# Altium schematic sheet Top.SchDoc
size B; Revision: 1.1; SheetNumber: 1; SheetTotal: 6
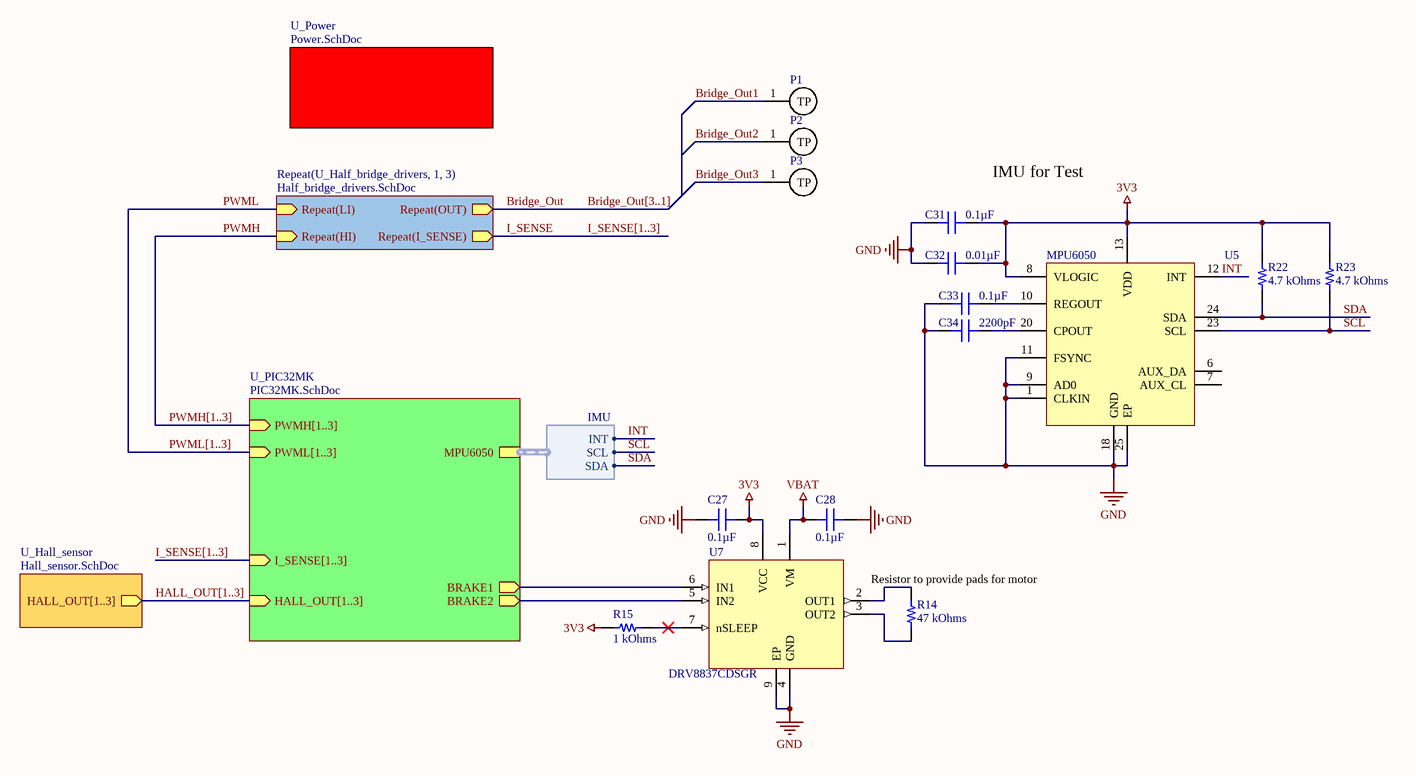
[diagram p0: Top.SchDoc]

## Parts
C27  0.1µF  [CAP 0603_1608]
C28  0.1µF  [CAP 0603_1608]
C31  0.1µF  [CAP 0603_1608]
C32  0.01µF  [CAP 0603_1608]
C33  0.1µF  [CAP 0603_1608]
C34  2200pF  [CAP 0603_1608]
P1  TP  [2mmHole]  (value not drawn)
P2  TP  [2mmHole]  (value not drawn)
P3  TP  [2mmHole]  (value not drawn)
R14  47 kOhms  [RES 2512_6432]
R15  1 kOhms  [RES 0603_1608]
R22  4.7 kOhms  [RES 0603_1608]
R23  4.7 kOhms  [RES 0603_1608]
U5  MPU6050  [IC_MPU6050]
U7  DRV8837CDSGR  [SON50P200X200X80-9N]

## Sub-sheets
Repeat(U_Half_bridge_drivers, 1, 3) = Half_bridge_drivers.SchDoc: Repeat(LI) (in), Repeat(HI) (in), Repeat(OUT) (out), Repeat(I_SENSE) (out)
U_Hall_sensor = Hall_sensor.SchDoc: HALL_OUT[1..3] (out)
U_PIC32MK = PIC32MK.SchDoc: HALL_OUT[1..3] (in), PWMH[1..3] (in), PWML[1..3] (in), BRAKE2 (out), BRAKE1 (out), I_SENSE[1..3] (in), MPU6050 (harness IMU)
U_Power = Power.SchDoc: no entries

## Harnesses
IMU: INT, SCL, SDA

## Nets
3V3: C27.2 C31.2 C32.2 R15.2 R22.2 R23.2 U5.8(VLOGIC) U5.13(VDD) U7.8(VCC)
GND: C27.1 C28.2 C31.1 C32.1 C33.2 C34.2 U5.1(CLKIN) U5.9(AD0) U5.11(FSYNC) U5.18(GND) U5.25(EP) U7.4(GND) U7.9(EP)
VBAT: C28.1 U7.1(VM)
Bridge_Out: sheet Repeat(U_Half_bridge_drivers, 1, 3)/Repeat(OUT)
Bridge_Out1: P1.1(TP)
Bridge_Out2: P2.1(TP)
Bridge_Out3: P3.1(TP)
I_SENSE: sheet Repeat(U_Half_bridge_drivers, 1, 3)/Repeat(I_SENSE)
INT: U5.12(INT) ; sheet U_PIC32MK/MPU6050.INT
PWMH: sheet Repeat(U_Half_bridge_drivers, 1, 3)/Repeat(HI)
PWML: sheet Repeat(U_Half_bridge_drivers, 1, 3)/Repeat(LI)
SCL: R23.1 U5.23(SCL) ; sheet U_PIC32MK/MPU6050.SCL
SDA: R22.1 U5.24(SDA) ; sheet U_PIC32MK/MPU6050.SDA
NetC33_1: C33.1 U5.10(REGOUT)
NetC34_1: C34.1 U5.20(CPOUT)
NetR14_1: R14.1 U7.2(OUT1)
NetR14_2: R14.2 U7.3(OUT2)
NetR15_1: R15.1 U7.7(nSLEEP)
NetU7_5: U7.5(IN2) ; sheet U_PIC32MK/BRAKE2
NetU7_6: U7.6(IN1) ; sheet U_PIC32MK/BRAKE1

Not connected (* = marked no-connect by the designer): U5 6(AUX_DA) 7(AUX_CL)

## Buses and harness runs
bus Bridge_Out[3..1]
bus HALL_OUT[1..3] = sheet U_Hall_sensor/HALL_OUT[1..3] = sheet U_PIC32MK/HALL_OUT[1..3]
bus I_SENSE[1..3]
bus I_SENSE[1..3] = sheet U_PIC32MK/I_SENSE[1..3]
bus PWMH[1..3] = sheet U_PIC32MK/PWMH[1..3]
bus PWML[1..3] = sheet U_PIC32MK/PWML[1..3]

## Notes on the sheet
- (near C31) IMU for Test
- (near R14) Resistor to provide pads for motor

## Library data of the parts
C27 C28 C31 C33 = GCG188R92A104KA03D: CAP CER 0.1UF 100V 0603 EPOXY; Manufacturer: Murata Electronics; Temperature Coefficient: X8R; Tolerance: ±10%; Part Number: GCG188R92A104KA03D; Value: 0.1µF; Applications: Automotive; Capacitance: 0.1µF; ComponentLink1Description: Datasheet; ComponentLink1URL: https://search.murata.co.jp/Ceramy/image/img/A01X/G101/ENG/GCG188R92A104KA03-01.pdf; ComponentLink2Description: DigiKey Link; ComponentLink2URL: http://digikey.com/product-detail/en/murata-electronics/GCG188R92A104KA03D/490-18197-1-ND/9867926; Device Package: 0603 (1608 Metric); Features: Epoxy Mountable; LastUpdated: 21-Jan-20 12:01:59 AM; Lifecycle Status: Active; Minimum Order: 1; Mounting Type: Surface Mount, MLCC, Epoxy; Operating Temperature: -55°C ~ 150°C; Package / Case: 0603 (1608 Metric); Packaging: TapeAndReel; PartId: 9025; Part Status: Active; Price: 0.07; Ratings: AEC-Q200; Series: GCG; Size / Dimension: 0.063" L x 0.031" W (1.60mm x 0.80mm); Supplier 1: DigiKey; Supplier Part Number 1: 490-18197-1-ND; Thickness (Max): 0.035" (0.90mm); Voltage - Rated: 100V
C32 = C0603C103KARACAUTO: CAP CER 0.01UF 250V X7R 0603; Manufacturer: KEMET; Tolerance: ±10%; Part Number: C0603C103KARACAUTO; Value: 0.01µF; Applications: Automotive, Bypass, Decoupling; Capacitance: 0.01µF; ComponentLink1Description: Datasheet; ComponentLink1URL: https://api.kemet.com/component-edge/download/datasheet/C0603C103KARACAUTO.pdf; ComponentLink2Description: DigiKey Link; ComponentLink2URL: http://digikey.com/product-detail/en/kemet/C0603C103KARACAUTO/399-17960-1-ND/9084030; Device Package: 0603 (1608 Metric); LastUpdated: 13-Aug-20 10:21:06 AM; Lifecycle Status: Active; Minimum Order: 1; Mounting Type: Surface Mount, MLCC; Operating Temperature: -55°C ~ 125°C; Package / Case: 0603 (1608 Metric); Packaging: TapeAndReel; PartId: 15195; Part Status: Active; Price: 0.25; Ratings: AEC-Q200; Series: SMD Auto X7R; Size / Dimension: 0.063" L x 0.031" W (1.60mm x 0.80mm); Supplier 1: DigiKey; Supplier Part Number 1: 399-17960-1-ND; Temperature Coefficient: X7R; Thickness (Max): 0.034" (0.87mm)
C34 = CGA3E2X8R1H222M080AD: CAP CER 2200PF 50V 0603 EPOXY; Manufacturer: TDK Corporation; Temperature Coefficient: X8R; Tolerance: ±20%; Part Number: CGA3E2X8R1H222M080AD; Value: 2200pF; Applications: Automotive; Capacitance: 2200pF; ComponentLink1Description: Datasheet; ComponentLink1URL: https://product.tdk.com/info/en/catalog/datasheets/mlcc_automotive_epoxy_en.pdf?ref_disty=digikey; ComponentLink2Description: DigiKey Link; ComponentLink2URL: http://digikey.com/product-detail/en/tdk-corporation/CGA3E2X8R1H222M080AD/445-9890-1-ND/3931817; Device Package: 0603 (1608 Metric); Features: Epoxy Mountable; LastUpdated: 13-Aug-20 10:19:25 AM; Lifecycle Status: Active; Minimum Order: 1; Mounting Type: Surface Mount, MLCC, Epoxy; Operating Temperature: -55°C ~ 150°C; Package / Case: 0603 (1608 Metric); Packaging: TapeAndReel; PartId: 17643; Part Status: Active; Price: 0.05; Ratings: AEC-Q200; Series: CGA; Size / Dimension: 0.063" L x 0.031" W (1.60mm x 0.80mm); Supplier 1: DigiKey; Supplier Part Number 1: 445-9890-1-ND; Thickness (Max): 0.031" (0.80mm)
R14 = RK73B3ATTE473J: RES 47K OHM 5% 1W 2512; Manufacturer: KOA Speer Electronics, Inc.; Temperature Coefficient: ±200ppm/°C; Part Number: RK73B3ATTE473J; ComponentLink1Description: Datasheet; ComponentLink1URL: http://www.koaspeer.com/catimages/Products/RK73B/RK73B.pdf; ComponentLink2Description: DigiKey Link; ComponentLink2URL: http://digikey.com/product-detail/en/koa-speer-electronics-inc/RK73B3ATTE473J/2019-RK73B3ATTE473JCT-ND/10425370; Composition: Thick Film; Device Package: 2512 (6432 Metric); Features: Automotive AEC-Q200, Moisture Resistant; Height - Seated (Max): 0.028" (0.70mm); LastUpdated: 21-Jan-20 4:26:21 AM; Lifecycle Status: Active; Minimum Order: 1; Number of Terminations: 2; Operating Temperature: -55°C ~ 155°C; Package / Case: 2512 (6432 Metric); Packaging: TapeAndReel; Part Status: Active; Power (Watts): 1W; Price: 0.04; Ratings: AEC-Q200; Resistance: 47 kOhms; Series: RK73B; Size / Dimension: 0.248" L x 0.122" W (6.30mm x 3.10mm); Supplier 1: DigiKey; Supplier Part Number 1: 2019-RK73B3ATTE473JCT-ND; Supplier Device Package: 2512; Tolerance: ±5%; Value: 47 kOhms
R15 = RT0603FRE071KL: RES SMD 1K OHM 1% 1/10W 0603; Manufacturer: Yageo; Power (Watts): 0.1W, 1/10W; Temperature Coefficient: ±50ppm/°C; Part Number: RT0603FRE071KL; Value: 1 kOhms; ComponentLink1Description: Datasheet; ComponentLink1URL: https://www.yageo.com/upload/media/product/productsearch/datasheet/rchip/PYu-RT_1-to-0.01_RoHS_L_11.pdf; ComponentLink2Description: DigiKey Link; ComponentLink2URL: http://digikey.com/product-detail/en/yageo/RT0603FRE071KL/YAG2323CT-ND/5252437; Composition: Thin Film; Device Package: 0603 (1608 Metric); Height - Seated (Max): 0.022" (0.55mm); LastUpdated: 21-Jan-20 12:24:38 AM; Lifecycle Status: Active; Minimum Order: 1; Number of Terminations: 2; Operating Temperature: -55°C ~ 155°C; Package / Case: 0603 (1608 Metric); Packaging: TapeAndReel; PartId: 5672; Part Status: Active; Price: 0.01; Resistance: 1 kOhms; Series: RT; Size / Dimension: 0.063" L x 0.031" W (1.60mm x 0.80mm); Supplier 1: DigiKey; Supplier Part Number 1: YAG2323CT-ND; Supplier Device Package: 0603; Tolerance: ±1%
R22 R23 = CPF-A-0603B4K7E: RES SMD 4.7K OHM 0.1% 1/16W 0603; Manufacturer: TE Connectivity Passive Product; Power (Watts): 0.063W, 1/16W; Temperature Coefficient: ±25ppm/°C; Part Number: CPF-A-0603B4K7E; Value: 4.7 kOhms; ComponentLink1Description: Datasheet; ComponentLink1URL: https://www.te.com/commerce/DocumentDelivery/DDEController?Action=srchrtrv&DocNm=1773200-1&DocType=DS&DocLang=English; ComponentLink2Description: DigiKey Link; ComponentLink2URL: http://digikey.com/product-detail/en/te-connectivity-passive-product/CPF-A-0603B4K7E/A124067CT-ND/5969987; Composition: Thin Film; Device Package: 0603 (1608 Metric); Features: Anti-Sulfur, Automotive AEC-Q200, Moisture Resistant; Height - Seated (Max): 0.022" (0.55mm); LastUpdated: 13-Aug-20 10:37:07 AM; Lifecycle Status: Active; Minimum Order: 1; Number of Terminations: 2; Operating Temperature: -55°C ~ 155°C; Package / Case: 0603 (1608 Metric); Packaging: TapeAndReel; PartId: 8242; Part Status: Active; Price: 0.09; Ratings: AEC-Q200; Resistance: 4.7 kOhms; Series: CPF-A, Neohm; Size / Dimension: 0.061" L x 0.031" W (1.55mm x 0.80mm); Supplier 1: DigiKey; Supplier Part Number 1: A124067CT-ND; Supplier Device Package: 0603; Tolerance: ±0.1%
U7 = DRV8837CDSGR: 11-V, 1-A H-bridge motor driver 8-WSON -40 to 85; MF: Texas Instruments; Mouser-Purchase-URL: https://snapeda.com/shop?store=Mouser&id=617854; Value: *; DigiKey-Purchase-URL: https://snapeda.com/shop?store=DigiKey&id=617854; Package: WSON-8 Texas Instruments; Texas_Instruments-Purchase-URL: https://snapeda.com/shop?store=Texas+Instruments&id=617854; Price: None; MP: DRV8837CDSGR; SnapEDA_Link: https://www.snapeda.com/parts/DRV8837CDSGR/Texas%20Instruments/view-part/617854/?ref=snap; Availability: Good